# Altium project Solar Boiler.PrjPcb
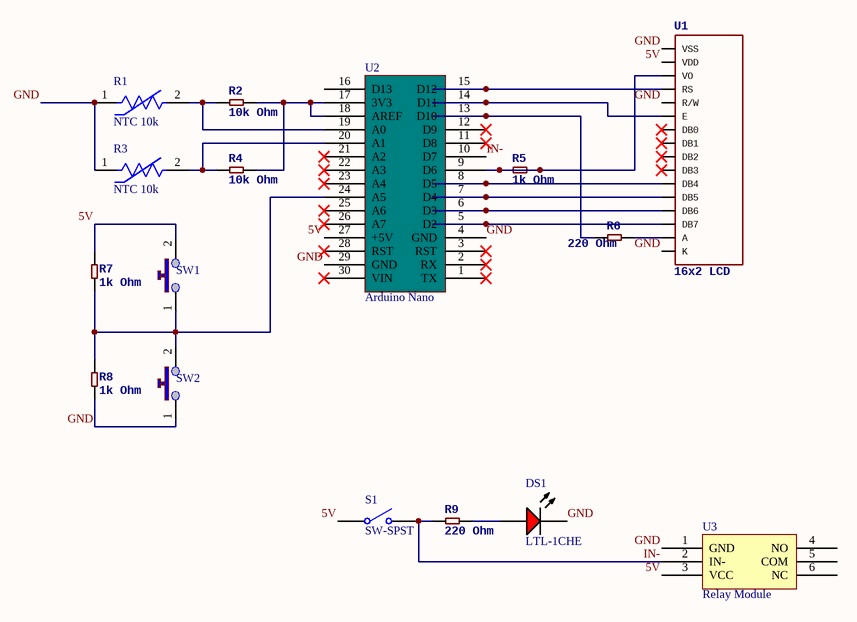
[diagram p0: Schematic.SchDoc]
1 sheet, 16 parts. Net scope: global (net labels, ports and power ports of the same name join across sheets).

## Sheet Schematic.SchDoc
size A; SheetNumber: 1; SheetTotal: 1

### Parts
DS1  LTL-1CHE  [INDPR60-254-520X380X650]
R1  NTC 10k  [FP-NTCLE305E4103SB-MFG]
R2  10k Ohm  [Res 1/4w]
R3  NTC 10k  [FP-NTCLE305E4103SB-MFG]
R4  10k Ohm  [Res 1/4w]
R5  1k Ohm  [Res 1/4w]
R6  220 Ohm  [Res 1/4w]
R7  1k Ohm  [Res 1/4w]
R8  1k Ohm  [Res 1/4w]
R9  220 Ohm  [Res 1/4w]
S1  SW-SPST  [SPST-2]
SW1  (no value)  [2 Pin Solder Cable]
SW2  (no value)  [2 Pin Solder Cable]
U1  16x2 LCD  [LCD-16X2]
U2  Arduino Nano  [PCBComponent_1]
U3  Relay Module  [RelayModule]

### Nets
5V: R7.2 S1.1(COMMON) SW1.2 U1.2(VDD) U2.27(+5V) U3.3(VCC)
GND: DS1.2(K) R1.1 R3.1 R8.1 SW2.1 U1.1(VSS) U1.5(R/W) U1.16(K) U2.4(GND) U2.29(GND) U3.1(GND)
IN-: R9.1 S1.2(NO) U2.10(D7) U3.2(IN-)
NetDS1_1: DS1.1(A) R9.2
NetR1_2: R1.2 R2.1 U2.19(A0)
NetR2_2: R2.2 R4.2 U2.17(3V3) U2.18(AREF)
NetR3_2: R3.2 R4.1 U2.20(A1)
NetR5_1: R5.1 R5.2 U1.3(VO) U2.9(D6)
NetR6_1: R6.1 U2.13(D10)
NetR6_2: R6.2 U1.15(A)
NetR7_1: R7.1 R8.2 SW1.1 SW2.2 U2.24(A5)
NetU1_4: U1.4(RS) U2.15(D12)
NetU1_6: U1.6(E) U2.14(D11)
NetU1_11: U1.11(DB4) U2.8(D5)
NetU1_12: U1.12(DB5) U2.7(D4)
NetU1_13: U1.13(DB6) U2.6(D3)
NetU1_14: U1.14(DB7) U2.5(D2)

Not connected (* = marked no-connect by the designer): U1 7(DB0)* 8(DB1)* 9(DB2)* 10(DB3)*; U2 1(TX)* 2(RX)* 3(RST)* 11(D8)* 12(D9)* 16(D13) 21(A2)* 22(A3)* 23(A4)* 25(A6)* 26(A7)* 28(RST)* 30(VIN)*; U3 4(NO) 5(COM) 6(NC)

### Library data of the parts
DS1 = CMP-007-00018-2: LED Uni-Color Red, 100 mW, 30 mA, -55 to 100 degC, 2-Pin THD, RoHS, Bulk; Manufacturer: Lite-On; Forward Current: 20mA; Nominal Vf: 2V; Viewing Angle: 60degrees; Luminous Intensity: 12.6mcd; Lens Style: Dome; Pins: 2; RoHS Compliant: True; Package Reference: LTL-1CHE; Package Quantity: 1000; Mounting Technology: TH; Min Operating Temperature: -55°C; Colour: Red; Case/Package: Radial; Manufacturer URL: http://www.us.liteon.com/; Datasheet URL: https://datasheet.ciiva.com/15117/getdatasheetpartid-187746-15117985.pdf; Forward Voltage: 2V; Max Operating Temperature: 100°C; Illumination Colour: Red; Package Description: 2-Pin Through Hole Device, Dia 3.8 mm, Pitch 2.54 mm; Packaging: Bulk; Datasheet Version: Dec-03
R1 R3 = CMP-02404-000012-1: THERMISTOR NTC 10KOHM 3984K BEAD; Resistance: 10kR; Resistance Tolerance: 2.2%; Accuracy: 0.5%; Max Power Dissipation: 50mW; Mount: Through Hole; Case/Package: Radial; Number of Pins: 2; Series: NTCLE305E4...SB; Tolerance: 2.2%; Package Quantity: 1000; Termination: Radial; Contact Plating: Silver; Min Operating Temperature: -40°C; Radiation Hardening: No; RoHS Compliant: Yes; Packaging: Bulk; Max Operating Temperature: 125°C
R2 R4-R9 = RES_THT
S1 = SW-SPST: Single-Pole, Single-Throw Switch; Published: 24-Mar-1999; LatestRevisionDate: 17-Jul-2002; LatestRevisionNote: Re-released for DXP Platform.; PackageReference: SPST-2; Publisher: Altium Limited; PackageDescription: Switch; 2 Leads
SW1 SW2 = Push Button
U1 = LCD-16X2SILK
U2 = Component_1